# EAGLE design LED_Triangle (EAGLE 9.1.0)
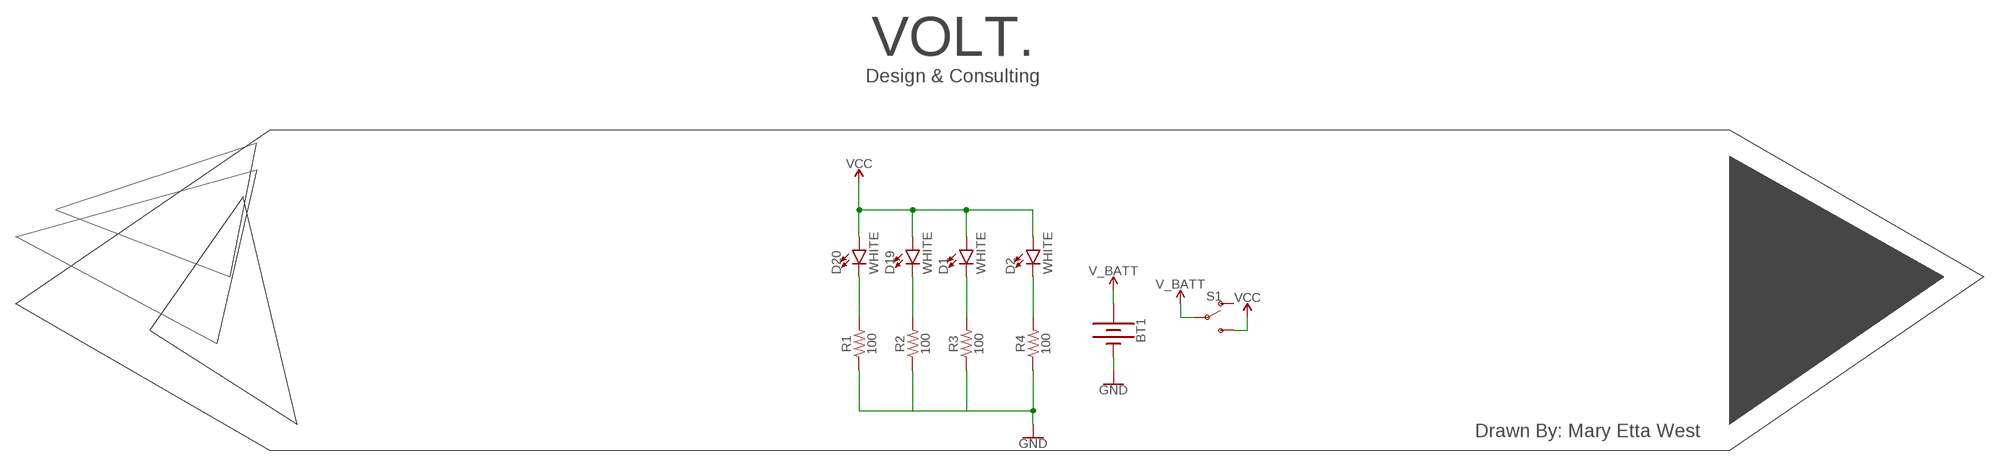
[diagram p0: schematic, sheet 1]

## Parts
BT1  BATTERY-12MM_SMD  [BATTCON_12MM]
D1  WHITE  LED-WHITE1206  [LED-1206]
D2  WHITE  LED-WHITE1206  [LED-1206]
D19  WHITE  LED-WHITE1206  [LED-1206]
D20  WHITE  LED-WHITE1206  [LED-1206]
R1  100  100OHM-0603-1/4W-5%  [0603]
R2  100  100OHM-0603-1/4W-5%  [0603]
R3  100  100OHM-0603-1/4W-5%  [0603]
R4  100  100OHM-0603-1/4W-5%  [0603]
S1  SWITCH-SPDT-SMD-RIGHT-ANGLE  [SWITCH_SPST_SMD_A]

## Nets
GND: BT1.GND(-) R1.1 R2.1 R3.1 R4.1
N$1: D20.C R1.2
N$2: D19.C R2.2
N$3: D1.C R3.2
N$4: D2.C R4.2
V_BATT: BT1.PWR@1(+) S1.2(P)
VCC: D1.A D2.A D19.A D20.A S1.3(S)
Unconnected: S1.1(O)

## Notes on the sheet
- VOLT.
- Design & Consulting
- Drawn By: Mary Etta West

## Library data of the parts
BT1 = SparkFun-Batteries:BATTERY: Battery - Single Cell A variety of battery chemistries, sizes, and footprints. Device List: 20MM_PTH - Coin Cell Battery Holder - 20mm (PTH) <https://www.sparkfun.com/products/783> 6.8MM_PTH - Coin Cell Battery Holder - 6.8MM(SMD) <https://www.digikey.com/product-detail/en/seiko-instruments/MS621FE-FL11E/728-1057-ND/1889208?WT.srch=1&gclid=CNOQ5a6LzdQCFZS2wAodXCkE0g> 12MM_SMD - Coin Cell Battery Holder - 12mm (SMD) <https://www.sparkfun.com/products/10592> 12MM_PTH - Coin Cell Battery Holder - 12mm (PTH) <https://www.sparkfun.com/products/7948> 20MM_SMD - 20mm Coin Cell Battery Holder (SMD) (2 legs) Used on the Big Time Watch Kit <https://www.sparkfun.com/products/11734> 20MM_SMD_4LEGS - Coin Cell Battery Holder - 20mm (SMD) <https://www.sparkfun.com/products/11892> 20MM_SMD_4LEGS_OVERPASTE - Coin Cell Battery Holder - 20mm (SMD) <https://www.sparkfun.com/products/11892> (Over-paste on the legs) 24.5MM_PTH - Coin Cell Battery Holder - 24.5mm (PTH) <https://www.sparkfun.com/products/8863> 9V - 9V Battery Holder - PC Mount Used on the SparkFun SparkPunk Sound Kit <https://www.sparkfun.com/products/11177> and SparkFun SparkPunk Sequencer Kit <https://www.sparkfun.com/products/12707> 18650 - Battery Holder - 18650 (PTH) <https://www.sparkfun.com/products/13113> AA - Battery Holder - 1xAA (PTH) <https://www.sparkfun.com/products/7949> AAA - Battery Holder - 1xAAA (PTH) <https://www.sparkfun.com/products/12718> AA_KIT - Battery Holder - 1xAA (PTH) <https://www.sparkfun.com/products/7949> Special kit package - pads only have exposed copper on one side of the board. AAA_KIT - Battery Holder - 1xAAA (PTH) <https://www.sparkfun.com/products/12718> Special kit package - pads only have exposed copper on one side of the board.; PROD_ID: BATT-08044; SF_SKU: PRT-10592
D1 D2 D19 D20 = SparkFun-LED:LED-WHITE: White SMD LED Used in manufacturing several products at SparkFun. Packages: 0603 - Bright White SMD 0603 package[Product Link] <http://www.kingbrightusa.com/product.asp?catalog_name=LED&product_id=APT1608QWF/D> 1206 - Bright White SMD1206 package [Product Link] <http://www.kingbrightusa.com/product.asp?catalog_name=LED&product_id=APT3216QWF/D> 3014 - Super Bright SMD 3014 package [Datasheet] <http://www.lumileds.com/uploads/459/DS208-pdf> SparkFun Products: Blackberry Trackballer Breakout <https://www.sparkfun.com/products/13169> Digital SandBox <https://www.sparkfun.com/products/12651>; PROD_ID: DIO-09955
R1-R4 = SparkFun-Resistors:100OHM: 100Ω resistor A resistor is a passive two-terminal electrical component that implements electrical resistance as a circuit element. Resistors act to reduce current flow, and, at the same time, act to lower voltage levels within circuits. - Wikipedia; PROD_ID: RES-12438
S1 = SparkFun-Switches:SWITCH-SPDT: Single Pole, Double Throw (SPDT) Switch Single-pole, double-throw (SPDT) switch. Variant Overview SMD-AYZ0202 Surface Mount DPDT Switch <https://www.sparkfun.com/products/597> (COM-00597) Used on e.g. LilyPad Arduino USB - ATmega32U4 Board <https://www.sparkfun.com/products/12049> PTH-11.6X4.0MM SPDT Mini Power Switch <https://www.sparkfun.com/products/102> (COM-00102) Used on e.g. SparkFun Simon Says - Through-Hole Soldering Kit <https://www.sparkfun.com/products/10547> (KIT-10547) PTH-11.6X4.0MM-KIT KIT version of SPDT Mini Power Switch - Simplifies soldering by removing tStop of switch pins - only one side can be soldered. PTH-11.6X4.0MM-LOCK LOCK version of SPDT Mini Power Switch - Offset pins hold switch in place for easier soldering. SMD-RIGHT-ANGLE Surface Mount Right Angle Switch <https://www.sparkfun.com/products/10860> (COM-10860) Used on e.g. SparkFun ESP8266 Thing <https://www.sparkfun.com/products/13231>; PROD_ID: SWCH-10651; SF_SKU: COM-10860

## Board
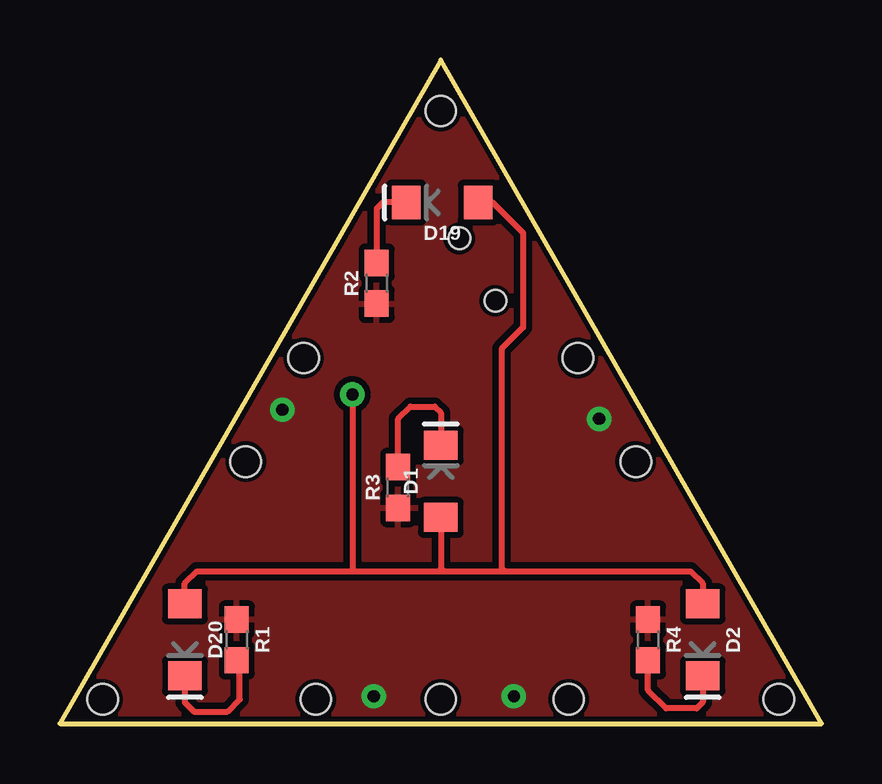
[diagram p1: board, top side]
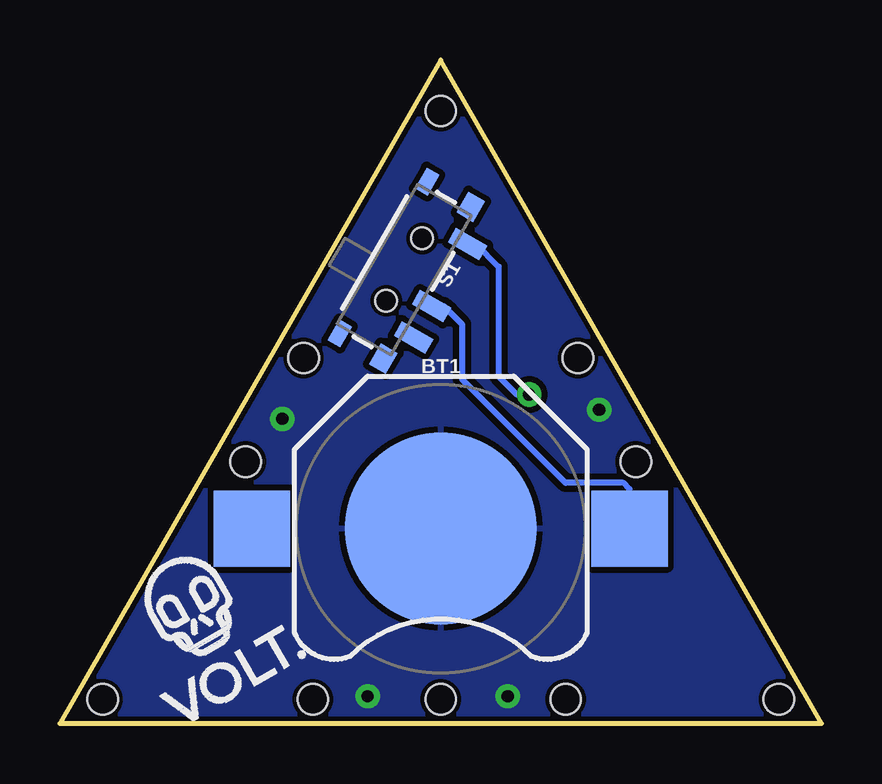
[diagram p2: board, bottom side, seen from below]

Size 31.75 x 27.65 mm. Coordinates in mm from the lower left corner, seen from the top.
Outline: 15.88,27.65 31.75,0 0,0 15.88,27.62
Copper layers (1*16): Top 0.035mm / dielectric 1.5mm / Bottom 0.035mm
Design rules "SparkFun-2-layer-STANDARD": minimum track width 10mil, minimum drill 20mil, track to track 10mil, track to pad 8mil, pad to pad 8mil, via to via 10mil, smd to smd 8mil, copper to edge 8mil, drill to drill 8mil, minimum pad ring 10mil, minimum via ring 10mil, stop-mask expansion 4mil, vias tented up to drill 25mil, thermal gap 10mil
Holes 1.27 mm at 15.88,25.53 29.97,1.02 1.78,1.02 7.75,10.92 10.16,15.24 21.59,15.24 24,10.92 15.88,1.02 10.67,1.02 21.21,1.02

### Footprints (pad centres in the part's own frame; a part is rotated, then mirrored left to right if it is on the bottom)
BATTCON_12MM = smd 8 x 8: GND 0,0 | smd 3.175 x 3.175: PWR@1 -7.874,0; PWR@2 7.874,0
LED-1206 = smd 1.2 x 1.4: A -1.5,0; C 1.5,0
0603 = smd 1.1 x 1: 1 -0.85,0; 2 0.85,0
SWITCH_SPST_SMD_A = smd 0.7 x 1.5: 1 -2.25,-1.75; 2 -0.75,-1.75; 3 2.25,-1.75 | smd 1 x 0.6: GND1 -3.65,1; GND3 3.65,1 | smd 1 x 0.8: GND2 -3.65,-1.1; GND4 3.65,-1.1 | hole 0.9: -1.5,0; 1.5,0

### Placement (x,y rotation side)
BT1  15.88,8.13 180 bottom
D1  15.88,10.1 90 top
D2  26.8,3.49 270 top
D19  15.94,21.72 180 top
D20  5.21,3.49 270 top
R1  7.37,3.49 270 top
R2  13.21,18.35 90 top
R3  14.1,9.84 90 top
R4  24.51,3.49 270 top
S1  17.4,18.92 60 bottom
U$1  [VOLT##LOGO#WHITE_#1##PNG]  25.4,3.68 30 bottom

### Tracks (layer width: path | path; a pad name or v marks a point on that pad's centre or on a via)
GND  (via drill 0.51)
  other vias: 13.08,1.14 18.92,1.14 22.48,12.7 9.27,13.08
  pour Top: 0,0 31.75,0 15.88,27.69
  pour Bottom: 0,0 31.75,0 15.88,27.69
N$1
  Top 0.254: D20.C 5.21,0.89 5.59,0.51 6.99,0.51 7.49,1.02 7.49,2.52 R1.2
N$2
  Top 0.254: D19.C 13.46,21.72 13.21,21.46 R2.2
N$3
  Top 0.254: R3.2 14.1,12.7 14.61,13.21 15.62,13.21 15.88,12.95 D1.C
N$4
  Top 0.254: D2.C 26.8,0.89 26.54,0.64 25.27,0.64 24.51,1.4 R4.2
V_BATT
  Bottom 0.254: S1.2 15.75,17.4 14.99,16.64 14.99,14.35 10.67,10.03 8.26,10.03 8,9.78 BT1.PWR@1
VCC  (via drill 0.51)
  Top 0.254: D20.A 5.21,5.84 5.71,6.35 12.19,6.35 | 12.19,6.35 16,6.35 | 16,6.35 18.54,6.35 | 18.54,6.35 26.29,6.35 26.8,5.84 D2.A | D1.A 15.88,6.48 16,6.35 | D19.A 18.03,21.72 19.3,20.45 19.3,16.51 18.41,15.62 18.41,6.48 18.54,6.35 | v12.19,13.72 12.19,6.35
  Bottom 0.254: v12.19,13.72 12.7,13.72 13.46,14.48 13.46,19.05 14.41,20 S1.3